# EAGLE schematic RFID1284 (EAGLE 6.2)
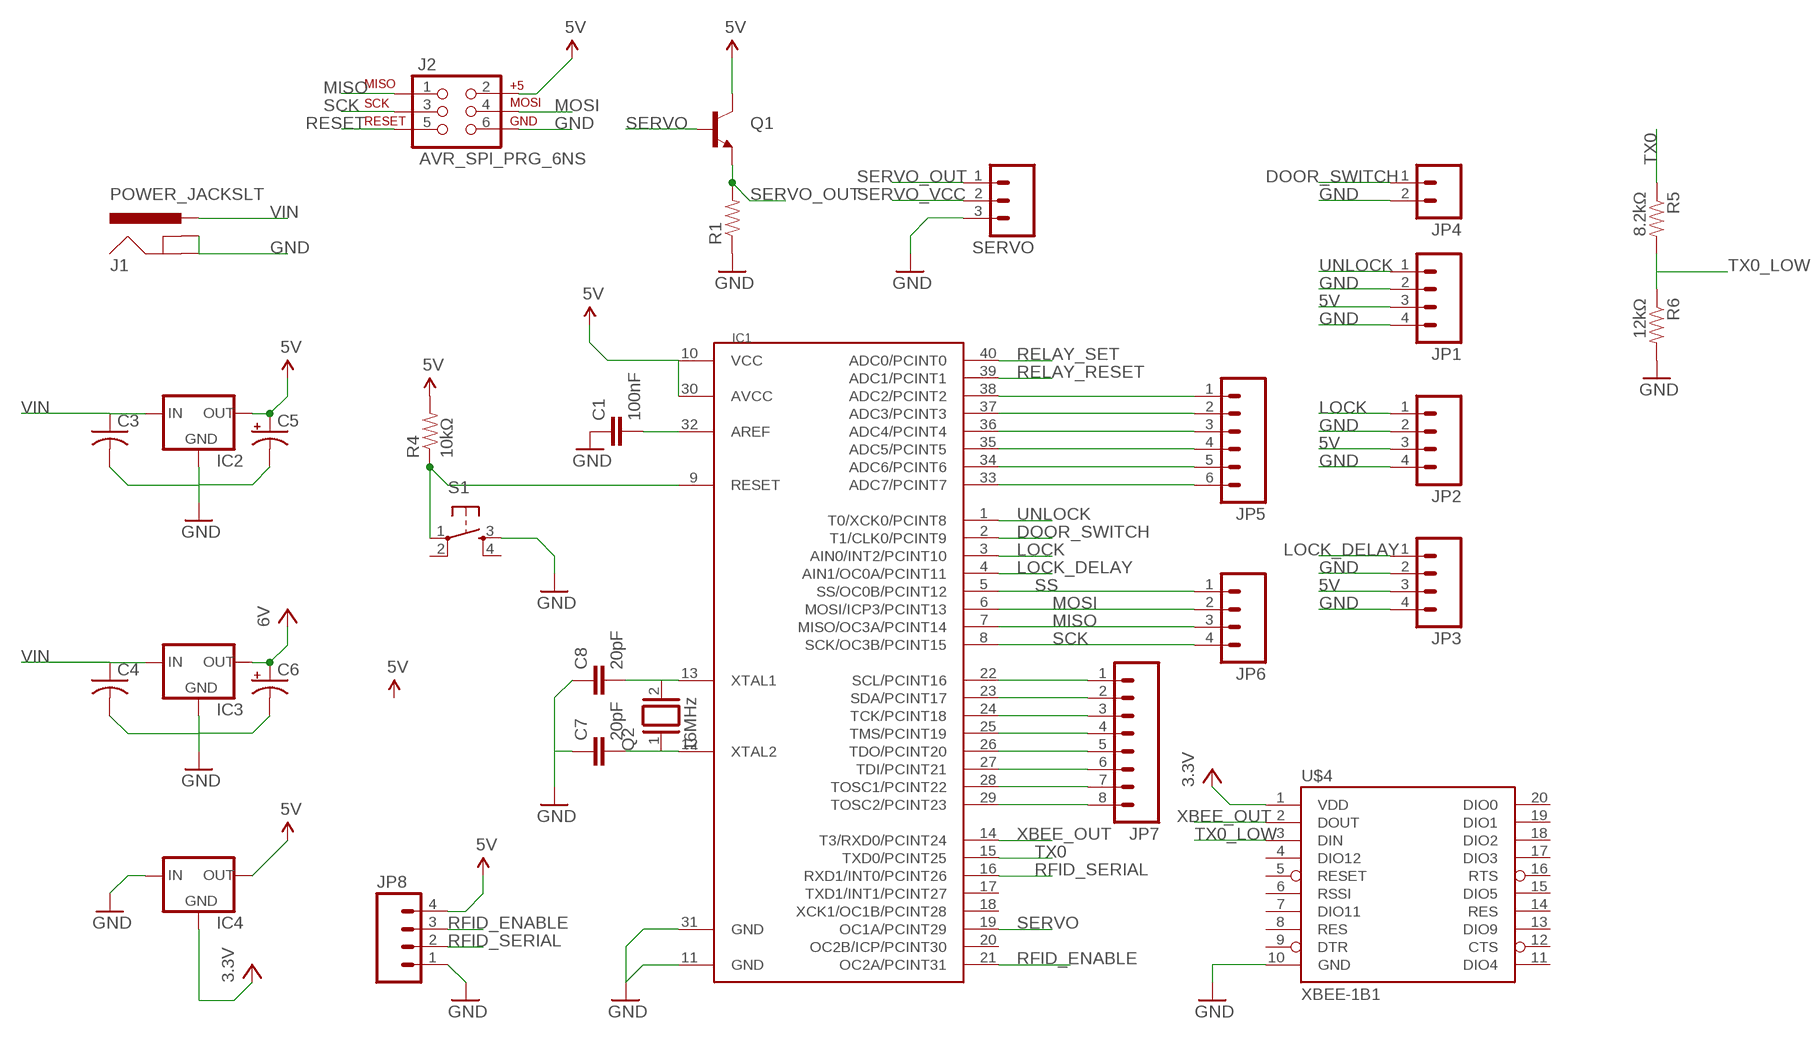
[diagram p0: schematic, sheet 1]

## Parts
C1  100nF  CAPPTH1  [CAP-PTH-5MM]
C3  C-US025-040X050  [C025-040X050]
C4  C-US025-040X050  [C025-040X050]
C5  CPOL-USE2.5-7  [E2,5-7]
C6  CPOL-USE2.5-7  [E2,5-7]
C7  20pF  CAPPTH1  [CAP-PTH-5MM]
C8  20pF  CAPPTH1  [CAP-PTH-5MM]
IC1  MEGA1284P  [DIL40]
IC2  V_REG_78XXSINK  [TO220-IGO]
IC3  V_REG_78XXSINK  [TO220-IGO]
IC4  V_REG_78XXSINK  [TO220-IGO]
J1  POWER_JACKSLT  [POWER_JACK_SLOT]
J2  AVR_SPI_PRG_6NS  [2X3-NS]
JP1  M04LOCK_LONGPADS  [1X04_LOCK_LONGPADS]
JP2  M04LOCK_LONGPADS  [1X04_LOCK_LONGPADS]
JP3  M04LOCK_LONGPADS  [1X04_LOCK_LONGPADS]
JP4  M02LOCK_LONGPADS  [1X02_LOCK_LONGPADS]
JP5  M06LOCK_LONGPADS  [1X06_LOCK_LONGPADS]
JP6  M04LOCK_LONGPADS  [1X04_LOCK_LONGPADS]
JP7  M08LOCK_LONGPADS  [1X08_LOCK_LONGPADS]
JP8  M04LONGPADS  [1X04_LONGPADS]
Q1  TRANSISTOR_NPNTO-92-AMMO  [TO-92-AMMO]
Q2  16MHz  XTAL/S  [QS]
R1  RESISTORPTH-1/4W  [AXIAL-0.4]
R4  10kΩ  RESISTORPTH-1/4W  [AXIAL-0.4]
R5  8.2kΩ  RESISTORPTH-1/4W  [AXIAL-0.4]
R6  12kΩ  RESISTORPTH-1/4W  [AXIAL-0.4]
S1  TAC_SWITCHPTH  [TACTILE-PTH]
SERVO  M03LONGPADS  [1X03_LONGPADS]
U$4  XBEE-1B1  [XBEE-1]

## Nets
5V: C5.+ IC1.10(VCC) IC1.30(AVCC) IC2.OUT IC4.OUT J2.2 JP1.3 JP2.3 JP3.3 JP8.4 Q1.3(C) R4.P$2
DOOR_SWITCH: IC1.2(T1/CLK0/PCINT9) JP4.1
GND: C1.1 C3.2 C4.2 C5.- C6.- C7.1 C8.1 IC1.11(GND) IC1.31(GND) IC2.GND IC3.GND IC4.IN J1.GND@1(GNDBREAK) J1.GND@2(GND) J2.6 JP1.2 JP1.4 JP2.2 JP2.4 JP3.2 JP3.4 JP4.2 JP8.1 R1.P$1 R6.P$2 S1.3 SERVO.3 U$4.10(GND)
LOCK: IC1.3(AIN0/INT2/PCINT10) JP2.1
LOCK_DELAY: IC1.4(AIN1/OC0A/PCINT11) JP3.1
MISO: IC1.7(MISO/OC3A/PCINT14) J2.1 JP6.3
MOSI: IC1.6(MOSI/ICP3/PCINT13) J2.4 JP6.2
N$1: C7.2 IC1.12(XTAL2) Q2.1
N$2: C1.2 IC1.32(AREF)
N$3: C8.2 IC1.13(XTAL1) Q2.2
N$6: IC1.38(ADC2/PCINT2) JP5.1
N$10: IC1.37(ADC3/PCINT3) JP5.2
N$11: IC1.36(ADC4/PCINT4) JP5.3
N$12: IC1.35(ADC5/PCINT5) JP5.4
N$13: IC1.34(ADC6/PCINT6) JP5.5
N$14: IC1.33(ADC7/PCINT7) JP5.6
N$19: IC1.22(SCL/PCINT16) JP7.1
N$20: IC1.23(SDA/PCINT17) JP7.2
N$21: IC1.24(TCK/PCINT18) JP7.3
N$22: IC1.25(TMS/PCINT19) JP7.4
N$23: IC1.26(TDO/PCINT20) JP7.5
N$24: IC1.27(TDI/PCINT21) JP7.6
N$25: IC1.28(TOSC1/PCINT22) JP7.7
N$26: IC1.29(TOSC2/PCINT23) JP7.8
RELAY_RESET: IC1.39(ADC1/PCINT1)
RELAY_SET: IC1.40(ADC0/PCINT0)
RESET: IC1.9(RESET) J2.5 R4.P$1 S1.1
RFID_ENABLE: IC1.21(OC2A/PCINT31) JP8.3
RFID_SERIAL: IC1.16(RXD1/INT0/PCINT26) JP8.2
SCK: IC1.8(SCK/OC3B/PCINT15) J2.3 JP6.4
SERVO: IC1.19(OC1A/PCINT29) Q1.2(B)
SERVO_OUT: Q1.1(E) R1.P$2 SERVO.1
SERVO_VCC: C6.+ IC3.OUT SERVO.2 ; supply symbol labelled 6V
SS: IC1.5(SS/OC0B/PCINT12) JP6.1
TX0: IC1.15(TXD0/PCINT25) R5.P$1
TX0_LOW: R5.P$2 R6.P$1 U$4.3(DIN)
UNLOCK: IC1.1(T0/XCK0/PCINT8) JP1.1
VCC: IC4.GND U$4.1(VDD) ; supply symbol labelled 3.3V
VIN: C3.1 C4.1 IC2.IN IC3.IN J1.PWR
XBEE_OUT: IC1.14(T3/RXD0/PCINT24) U$4.2(DOUT)
Unconnected: IC1.17(TXD1/INT1/PCINT27) IC1.18(XCK1/OC1B/PCINT28) IC1.20(OC2B/ICP/PCINT30) S1.2 S1.4 U$4.4(DIO12) U$4.5(RESET) U$4.6(RSSI) U$4.7(DIO11) U$4.8(RES) U$4.9(DTR) U$4.11(DIO4) U$4.12(CTS) U$4.13(DIO9) U$4.14(RES) U$4.15(DIO5) U$4.16(RTS) U$4.17(DIO3) U$4.18(DIO2) U$4.19(DIO1) U$4.20(DIO0)

## Library data of the parts
C1 C7 C8 = SparkFun:CAP: Capacitor Standard 0603 ceramic capacitor, and 0.1" leaded capacitor.
C3 C4 = rcl:C-US: CAPACITOR, American symbol
C5 C6 = rcl:CPOL-US: POLARIZED CAPACITOR, American symbol
IC1 = 1284p:MEGA1284P: Atmel ATmega1284P 8-bit AVR Microcontroller
IC2-IC4 = SparkFun:V_REG_78XX: Voltage Regulator Standard 7805 5V regulator. IGO (Input Ground Output). Spark Fun Electronics SKU : COM-00107
J1 = SparkFun:POWER_JACK: Power Jack This is the standard 5.5mm barrel jack for power. The PTH is the most common, proven, reliable, footprint. All others are experimental. The Slot footprint only works if the mill layer is transmitted to the PCB fab house so be warned. Spark Fun Electronics SKU : PRT-00119. Mating wall wart : TOL-00298 (and others)
J2 = SparkFun:AVR_SPI_PRG_6: AVR ISP 6 Pin This is the reduced ISP connector for AVR programming. Common on Arduino. This footprint will take up less PCB space and can be used with a 10-pin to 6-pin adapter such as SKU: BOB-08508
JP1-JP3 JP6 JP8 = SparkFun:M04: Header 4 Standard 4-pin 0.1" header. Use with straight break away headers (SKU : PRT-00116), right angle break away headers (PRT-00553), swiss pins (PRT-00743), machine pins (PRT-00117), and female headers (PRT-00115). Molex polarized connector foot print use with SKU : PRT-08231 with associated crimp pins and housings. 1MM SMD Version SKU: PRT-10208
JP4 = SparkFun:M02: Header 2 Standard 2-pin 0.1" header. Use with straight break away headers (SKU : PRT-00116), right angle break away headers (PRT-00553), swiss pins (PRT-00743), machine pins (PRT-00117), and female headers (PRT-00115). Molex polarized connector foot print use with SKU : PRT-08233 with associated crimp pins and housings.
JP5 = SparkFun:M06: Header 6 Standard 6-pin 0.1" header. Use with straight break away headers (SKU : PRT-00116), right angle break away headers (PRT-00553), swiss pins (PRT-00743), machine pins (PRT-00117), and female headers (PRT-00115). Molex polarized connector foot print use with SKU : PRT-08094 with associated crimp pins and housings. NOTES ON THE VARIANTS LOCK and LOCK_LONGPADS... This footprint was designed to help hold the alignment of a through-hole component (i.e. 6-pin header) while soldering it into place. You may notice that each hole has been shifted either up or down by 0.005 of an inch from it's more standard position (which is a perfectly straight line). This slight alteration caused the pins (the squares in the middle) to touch the edges of the holes. Because they are alternating, it causes a "brace" to hold the component in place. 0.005 has proven to be the perfect amount of "off-center" position when using our standard breakaway headers. Although looks a little odd when you look at the bare footprint, once you have a header in there, the alteration is very hard to notice. Also, if you push a header all the way into place, it is covered up entirely on the bottom side. This idea of altering the position of holes to aid alignment will be further integrated into the Sparkfun Library for other footprints. It can help hold any component with 3 or more connection pins.
JP7 = SparkFun:M08: Header 8 Standard 8-pin 0.1" header. Use with straight break away headers (SKU : PRT-00116), right angle break away headers (PRT-00553), swiss pins (PRT-00743), machine pins (PRT-00117), and female headers (PRT-00115).
Q1 = SparkFun:TRANSISTOR_NPN: Transistor NPN BJT configuration in SOT23 package. MMBT2222 is the common NPN we use. Double check BCE configuration again layout.
Q2 = special:XTAL/S: CRYSTAL
R1 R4-R6 = SparkFun:RESISTOR: Resistor Basic schematic elements and footprints for 0603, 1206, and PTH resistors.
S1 = SparkFun:TAC_SWITCH: Momentary Switch Button commonly used for reset or general input. Spark Fun Electronics SKU : COM-00097
SERVO = SparkFun:M03: Header 3 Standard 3-pin 0.1" header. Use with straight break away headers (SKU : PRT-00116), right angle break away headers (PRT-00553), swiss pins (PRT-00743), machine pins (PRT-00117), and female headers (PRT-00115). Molex polarized connector foot print use with SKU : PRT-08232 with associated crimp pins and housings.
U$4 = SparkFun:XBEE-1